# EAGLE design Adafruit RGB Matrix HAT (EAGLE 9.6.2)
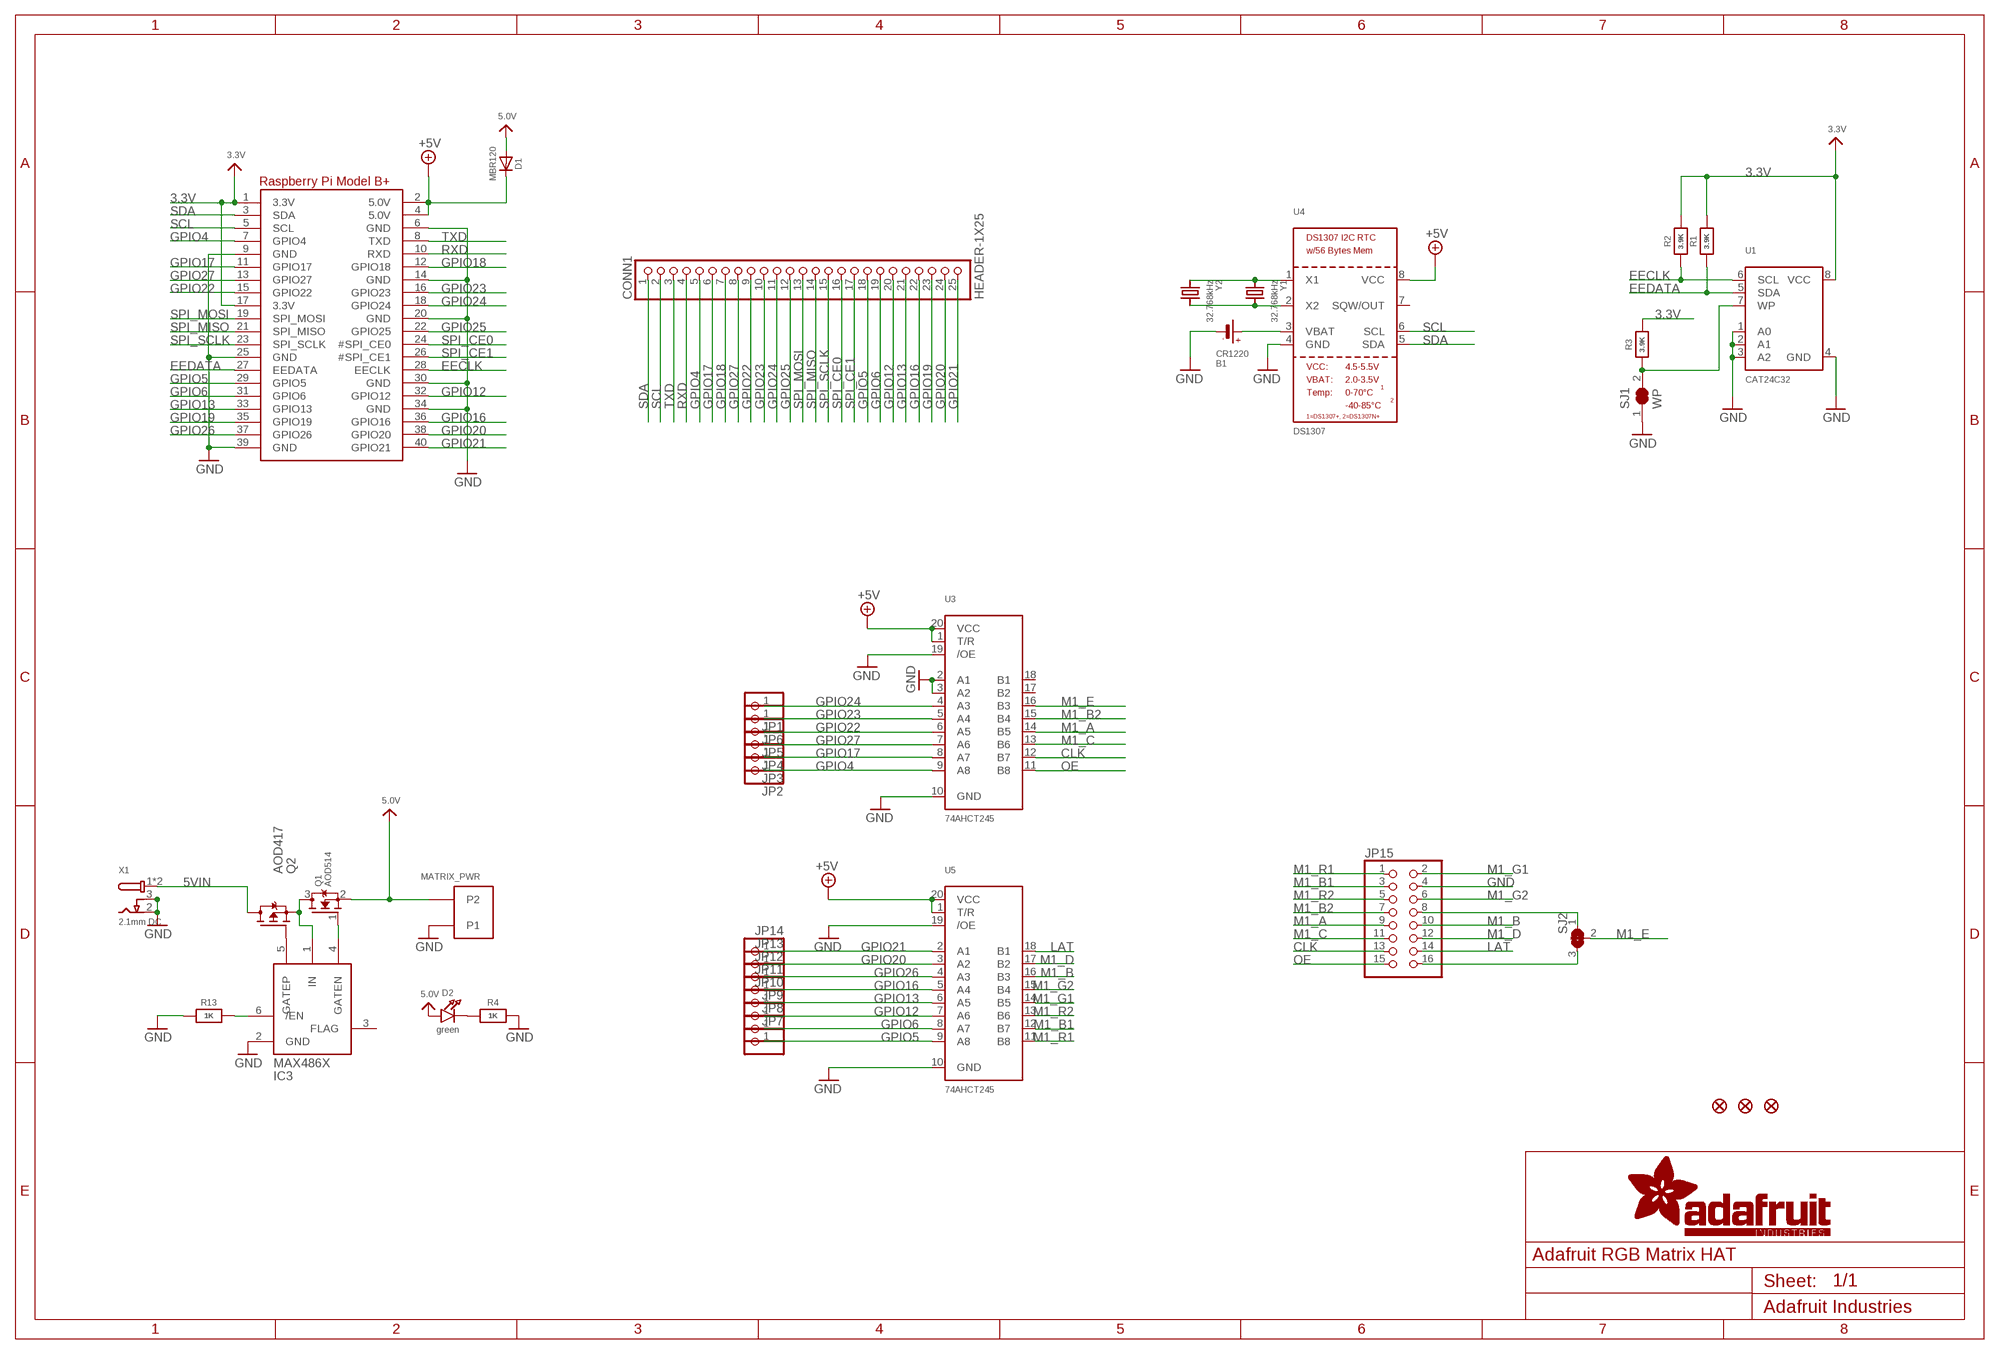
[diagram p0: schematic, sheet 1]

## Parts
B1  CR1220  BATTERYCR1220_SMT  [CR1220]
CONN1  HEADER-1X25  [1X25_ROUND_70MIL]
D1  MBR120  DIODESOD-123  [SOD-123]
D2  green  LED0805_NOOUTLINE  [CHIPLED_0805_NOOUTLINE]
FID1  FIDUCIAL_1MM  [FIDUCIAL_1MM]
FID2  FIDUCIAL_1MM  [FIDUCIAL_1MM]
FID3  FIDUCIAL_1MM  [FIDUCIAL_1MM]
IC3  MAX4866T  MAX486X/SOT  [SOT23-6]
JP1  PINHD-1X1  [1X01]
JP2  PINHD-1X1  [1X01]
JP3  PINHD-1X1  [1X01]
JP4  PINHD-1X1  [1X01]
JP5  PINHD-1X1  [1X01]
JP6  PINHD-1X1  [1X01]
JP7  PINHD-1X1  [1X01]
JP8  PINHD-1X1  [1X01]
JP9  PINHD-1X1  [1X01]
JP10  PINHD-1X1  [1X01]
JP11  PINHD-1X1  [1X01]
JP12  PINHD-1X1  [1X01]
JP13  PINHD-1X1  [1X01]
JP14  PINHD-1X1  [1X01]
JP15  HEADER-2X8_SHROUDED  [2X08_SHROUDED]
MATRIX_PWR  PINHEAD  [TERMBLOCK508]
Q1  AOD514  MOSFET-N_TO252  [TO252]
Q2  AOD417  MOSFET-PTO252  [TO252]
R1  3.9K  RESISTOR0805_NOOUTLINE  [0805-NO]
R2  3.9K  RESISTOR0805_NOOUTLINE  [0805-NO]
R3  3.9K  RESISTOR0805_NOOUTLINE  [0805-NO]
R4  1K  RESISTOR0805_NOOUTLINE  [0805-NO]
R13  1K  RESISTOR0805_NOOUTLINE  [0805-NO]
RPI1  RASPBERRYPI_BPLUS_HATSLOTS  [PI_HAT_SLOTS]
SJ1  WP  SOLDERJUMPER_CLOSED  [SOLDERJUMPER_CLOSEDWIRE]
SJ2  SOLDERJUMPER_2WAY  [SOLDERJUMPER_2WAY_OPEN_NOPASTE]
U1  CAT24C32  EEPROM_I2C_8PIN_GENERIC  [SOIC8_150MIL]
U3  74AHCT245  74LCX245_TSSOP20  [TSSOP20]
U4  DS1307  RTC_DS1307  [SOIC8_150MIL]
U5  74AHCT245  74LCX245_TSSOP20  [TSSOP20]
X1  2.1mm DC  DCBARRELSMT  [DCJACK_2MM_SMT]
Y1  32.768kHz  CRYSTAL8.0X3.8  [CRYSTAL_8X3.8]
Y2  32.768kHz  CRYSTAL_3215  [XTAL3215]

## Nets
3.3V: R1.2 R2.2 R3.2 RPI1.1(3.3V) RPI1.17(3.3V) U1.8(VCC)
5.0V: D1.A D2.A MATRIX_PWR.P$4(P2) Q1.2(S)
5VIN: Q2.3(D) X1.1'(PWR) X1.1(PWR)
+5V: D1.C RPI1.2(5.0V) RPI1.4(5.0V) U3.1(T/R) U3.20(VCC) U4.8(VCC) U5.1(T/R) U5.20(VCC)
CLK: JP15.13 U3.12(B7)
EECLK: R2.1 RPI1.28(EECLK) U1.6(SCL)
EEDATA: R1.1 RPI1.27(EEDATA) U1.5(SDA)
GND: B1.- IC3.2(GND) JP15.4 MATRIX_PWR.P$3(P1) R4.2 R13.1 RPI1.6(GND) RPI1.9(GND) RPI1.14(GND) RPI1.20(GND) RPI1.25(GND) RPI1.30(GND) RPI1.34(GND) RPI1.39(GND) SJ1.1 U1.1(A0) U1.2(A1) U1.3(A2) U1.4(GND) U3.2(A1) U3.3(A2) U3.10(GND) U3.19(/OE) U4.4(GND) U5.10(GND) U5.19(/OE) X1.2(GND) X1.3(GNDBREAK)
GPIO4: CONN1.5 JP2.1 RPI1.7(GPIO4) U3.9(A8)
GPIO5: CONN1.18 JP7.1 RPI1.29(GPIO5) U5.9(A8)
GPIO6: CONN1.19 JP8.1 RPI1.31(GPIO6) U5.8(A7)
GPIO12: CONN1.20 JP9.1 RPI1.32(GPIO12) U5.7(A6)
GPIO13: CONN1.21 JP10.1 RPI1.33(GPIO13) U5.6(A5)
GPIO16: CONN1.22 JP11.1 RPI1.36(GPIO16) U5.5(A4)
GPIO17: CONN1.6 JP3.1 RPI1.11(GPIO17) U3.8(A7)
GPIO18: CONN1.7 RPI1.12(GPIO18)
GPIO19: CONN1.23 RPI1.35(GPIO19)
GPIO20: CONN1.24 JP13.1 RPI1.38(GPIO20) U5.3(A2)
GPIO21: CONN1.25 JP14.1 RPI1.40(GPIO21) U5.2(A1)
GPIO22: CONN1.9 JP5.1 RPI1.15(GPIO22) U3.6(A5)
GPIO23: CONN1.10 JP6.1 RPI1.16(GPIO23) U3.5(A4)
GPIO24: CONN1.11 JP1.1 RPI1.18(GPIO24) U3.4(A3)
GPIO25: CONN1.12 RPI1.22(GPIO25)
GPIO26: JP12.1 RPI1.37(GPIO26) U5.4(A3)
GPIO27: CONN1.8 JP4.1 RPI1.13(GPIO27) U3.7(A6)
LAT: JP15.14 U5.18(B1)
M1_A: JP15.9 U3.14(B5)
M1_B: JP15.10 U5.16(B3)
M1_B1: JP15.3 U5.12(B7)
M1_B2: JP15.7 U3.15(B4)
M1_C: JP15.11 U3.13(B6)
M1_D: JP15.12 U5.17(B2)
M1_E: SJ2.2 U3.16(B3)
M1_E': JP15.8 SJ2.1
M1_E'': JP15.16 SJ2.3
M1_G1: JP15.2 U5.14(B5)
M1_G2: JP15.6 U5.15(B4)
M1_R1: JP15.1 U5.11(B8)
M1_R2: JP15.5 U5.13(B6)
N$1: IC3.6(/EN) R13.2
N$2: U4.1(X1) Y1.P$1 Y2.P$1
N$3: U4.2(X2) Y1.P$4 Y2.P$2
N$4: D2.C R4.1
N$5: IC3.1(IN) Q1.3(D) Q2.2(S)
N$6: IC3.4(GATEN) Q1.1(G)
N$7: IC3.5(GATEP) Q2.1(G)
N$14: B1.+$1(+) B1.+$2(+) U4.3(VBAT)
N$16: R3.1 SJ1.2 U1.7(WP)
OE: JP15.15 U3.11(B8)
RXD: CONN1.4 RPI1.10(RXD)
SCL: CONN1.2 RPI1.5(SCL) U4.6(SCL)
SDA: CONN1.1 RPI1.3(SDA) U4.5(SDA)
SPI_CE0: CONN1.16 RPI1.24(#SPI_CE0)
SPI_CE1: CONN1.17 RPI1.26(#SPI_CE1)
SPI_MISO: CONN1.14 RPI1.21(SPI_MISO)
SPI_MOSI: CONN1.13 RPI1.19(SPI_MOSI)
SPI_SCLK: CONN1.15 RPI1.23(SPI_SCLK)
TXD: CONN1.3 RPI1.8(TXD)
Unconnected: IC3.3(FLAG) U3.17(B2) U3.18(B1) U4.7(SQW/OUT)

## Library data of the parts
B1 = microbuilder:BATTERY: CR1220 SMT - Digikey: 3001K-ND CD2032 BAT-HLD-001 - Digikey: BAT-HLD-001-ND
CONN1 = microbuilder:HEADER-1X25
D1 = microbuilder:DIODE: Diode SMA Model Volts Amps Type Vf Ir Digikey # Notes SSA34-E3 40V 3A Schottky 480mV @ 3A 200uA @ 40V SSA34-E3/61TGITR-ND CDBA120-G 20V 1A Schottky 500mV @ 1A 500uA @ 20V 641-1014-6-ND REEL MBRA210 10V 2A Schottky 350mV @ 2A 700uA @ 10V MBRA210LT3 SOD-123 Model Volts Amps Type Vf Ir Order # Notes BAT54T1G 30V 200mA Schottky 800mV @ 200mA 2uA @ 25V BAT54T1GOSTR-ND B0530W 30V 500mA Schottky 430mV @ 500mA 130uA @ 30V B0530W-FDICT-ND REEL MBR120 20V 1A Schottky 340mV @ 1A MBR120VLSFT1GOSCT-ND SOD-323 Model Volts Amps Type Vf Ir Order # Notes PMEG2005EJ 20V 500mA Schottky 355mV @ 500mA 568-4110-1-ND ZLLS410 10V 570mA Schottky 380mV @ 570mA ZLLS410CT-ND 1N4148WS 75V 150mA Silicon/Simple 1V 1N4148WSFSCT-ND REEL SOD-523 Model Volts Amps Type Vf Ir Order # Notes BAT54XV2 30V 200mA Schottky 0.8V @ 100mA BAT54XV2CT-ND TB751S 30V 30mA Schottky RB751S-40TE61CT-ND SOT23-R/W (R = Solder Paste/Reflow Ovens, W = Hand-Soldering) Model Volts Amps Type Vf Ir Order # Notes BAT54FILM 40V 300mA Schottky 497-7162-1-ND POWERDI-5 Model Volts Amps Type Vf Ir Order # Notes PDS560 60V 5A Schottky 670mV @ 5A 150uA @ 60V PDS560DICT-ND
D2 = microbuilder:LED: LED 0603 - 0603 Surface Mount Package 2mA: Green LED - Low Power (3.9mcd, 2ma, 1.7Vf) - Digikey: 475-2709-2-ND Orange LED - Low Power (9.8mcd, 2ma, 1.8Vf) - Digikey: 475-1194-2-ND Red LED - Low Power (5mcd, 2ma, 1.8Vf) - Digikey: 475-1195-2-ND Yellow LED - Low Power (7mcd, 2ma, 1.8Vf) - Digikey: 475-1196-2-ND 5mA: Blue LED - Low Power (17mcd, 5ma, 2.9Vf) - Digikey: LNJ937W8CRACT-ND 0805 - 0805 Surface Mount Package 2mA: Red LED (8.8mcd, 2mA, 1.8Vf, Clear) - Low Power [Digikey: 475-2510-1-ND] Green LED (5mcd, 2mA, 1.8Vf, Clear) - Low Power [Digikey: 475-2730-1-ND] Yellow LED (11.3mcd, 2mA, 1.8Vf, Clear) - Low Power [Digikey: 475-2555-1-ND] 20mA: Red LED (104mcd, 20mA, Diffused) - LS R976 [Digikey: 475-1278-6-ND] Red LED (12mcd, 20mA, 2.0Vf, Clear) - APT2012EC [Digikey: 754-1128-1-ND] Green LED (15mcd, 20mA, 2.2Vf, Clear) - APT2012GC [Digikey: 754-1131-1-ND] Orange LED (160mcd, 20mA, 2.1Vf, Clear) - APT2012SECK [Digikey: 754-1130-1-ND] 1206 - 1206 Surface Mount Package Green LED (26mcd, 20mA, Diffused) - LG N971 [Digikey: 475-1407-6-ND] Red LED (15mcd, 20mA, Diffused) - LH N974 [Digikey: 475-1416-6-ND] Cree - Cree High-Power Surface Mount LEDs XPEBWT-L1-0000-00D50 - White 111lm 350mA 2.9Vf 6200K 110° XTEAWT-00-0000-00000LEE3 - White 114lm 350mA 2.85Vf 5000K 115° Everlight - Everlight 45-21 Series Surface Mount LEDs 45-21/QK2C-B2832AC2CB2/2T - Warm White 2000mcd 20mA 3.25Vf 3050K 120° 45-21/LK2C-B38452C4CB2/2T - Nuetral White 2000mcd 20mA 3.25Vf 4150K 120° 45-21/LK2C-B50634C6CB2/2T - Cold White 2200mcd 20mA 3.25Vf 5650K 120° PLCC2 Reverse Mount LS T77K-J1L2-1-0-2-R18-Z - Red 11.25mcd 2mA 1.8Vf 630nm 120° LO T77K-L1M2-24-Z - Orange 19.6mcd 2mA 1.8Vf 606nm 120° LY T77K-K2M1-26-Z - Yellow 15.7mcd 2mA 1.8Vf 587nm 120°; ROT: 270
FID1-FID3 = microbuilder:FIDUCIAL: Fiducial Alignment Points Various fiducial points for machine vision alignment.; BOM: EXCLUDE
IC3 = adafruit:MAX486X
JP1-JP14 = pinhead-ez:PINHD-1X1: PIN HEADER
JP15 = microbuilder:HEADER-2X8
MATRIX_PWR = mshield:PINHEAD
Q1 = microbuilder:MOSFET-N: N-Channel Mosfet LEGEND VDS: Voltage Drain-Source ID: Drain Current RDS(ON): Drain-Source On-State Resistance VGS(TH): Gate-Source Threshold Voltage CISS: Drain-Source Input Capacitance SOT-23 Name VDS ID RDS(ON) VGS(TH) CISS Order Number 2N7002E 60V 260mA 2.5 Ohm 2.5V @ 250uA 26.7pF @ 25V 2N7002ET1GOSTR-ND BSH103 30V 850mA 400 mOhm 400mV @ 1mA 83pF @ 24V BSH103,235-ND BSS138 60V 320mA 1.6 Ohm 1.5V @ 250uA 50pF @ 10V Mouser: 771-BSS138PW115 DMN2075U-7 20V 4.2A 38 mOhm 1V @ 250 uA 594.3pF @ 10V DMN2075U-7DICT-ND * BSS138 good choice for I2C level-shifting POWERPAK 1212-8 Name VDS ID RDS(ON) VGS(TH) CISS Order Number Si7308DN 60V 6A 58 mOhm 3V @ 250uA 665pF @ 15V SI7308DN-T1-E3CT-ND
Q2 = microbuilder:MOSFET-P: P-Channel Mosfet LEGEND VDS: Voltage Drain-Source ID: Drain Current RDS(ON): Drain-Source On-State Resistance VGS(TH): Gate-Source Threshold Voltage CISS: Drain-Source Input Capacitance SOT-23 Name VDS ID RDS(ON) VGS(TH) CISS Order Number IRLML5103 30V 760mA 600 mOhm -- 75pF @ 25V Digikey: IRLML5103PBFCT-ND IRLML6401 12V 4.3A 50 mOhm 950mV @ 250µA 830pF @ 10V Digikey: IRLML6401PBFTR-ND NTR0202PL 20V 400mA 800 mOhm 2.3V @ 250uA 70pF @ 5V Digikey: NTR0202PLT1GOSTR-ND NTR4101PT1G 20V 1.8A 85 mOhm 1.2V @ 250uA 675pF @ 10V Digikey: NTR4101PT1GOSCT-ND DMP2004K 20V 600mA 900 mOhm 1V @ 250uA 175pF @ 16V Digikey: DMP2004KDICT-ND PMV65XP 20V 3.9A 76 mOhm 950mV @ 1mA 725pF @ 20V Digikey: 568-2358-2-ND TO-252 Name VDS ID RDS(ON) VGS(TH) CISS Order Number AOD417 30V 25A 34 mOhm 3V @ 250µA 920pF @ 15V Digikey: 785-1106-2-ND PowerPak Name VDS ID RDS(ON) VGS(TH) CISS Order Number AON7401 30V 12A 14 mOhm 3V @ 250µA 2600pF @ 15V Digikey: 785-1302-1-ND
R1-R4 R13 = microbuilder:RESISTOR: Resistors For new designs, use the packages preceded by an '_' character since they are more reliable: The following footprints should be used on most boards: _0402 - Standard footprint for regular board layouts _0603 - Standard footprint for regular board layouts _0805 - Standard footprint for regular board layouts _1206 - Standard footprint for regular board layouts For extremely tight-pitch boards where space is at a premium, the following 'micro-pitch' footprints can be used (smaller pads, no silkscreen outline, etc.): _0402MP - Micro-pitch footprint for very dense/compact boards _0603MP - Micro-pitch footprint for very dense/compact boards _0805MP - Micro-pitch footprint for very dense/compact boards _1206MP - Micro-pitch footprint for very dense/compact boards
RPI1 = adafruit_sbc:RASPBERRYPI_BPLUS
SJ1 = microbuilder:SOLDERJUMPER_CLOSED: Solder Jumper - Closed These solder jumpers are closed by default CLOSEDWIRE - 10 mil trace between pads that can be cut and resoldered later CLOSEDPERM - 63 mil trace between pads for a permanent connection (used to 'bridge' two signals, a shameless hack for Eagle). Can double as a test point as well (no cream layer)
SJ2 = microbuilder:SOLDERJUMPER_2WAY: 2-Way Solder Jumper
U1 = microbuilder:EEPROM_I2C_8PIN_GENERIC: Note: The same pinout is used for many I2C EEPROMs in SOIC8(150mil) from a variety of manufacturers and in various sizes. Examples: 16K (2K x 8 Bit) I2C EEPROM 1.7-5.5V, 400KHz, -40°C-85°C Digikey: CAT24C16WI-GT3CT-ND 256K (32K x 8 Bit) I2C EEPROM 1.7-5.5V, 400KHz, -40°C-85°C Digikey: 24AA256-I/SN-ND
U3 U5 = microbuilder:74LCX245: 74LCX245MTC - 5.0V Tolerant Bi-Directional Buffer Can be used to interface 5.0V logic to 2.5 or 3.3V devices Digikey: 74LCX245MTCXTR-ND Mouser: 512-74LCX245MTCX
U4 = microbuilder:RTC_DS1307: DS1307 I2C RTC with 56-Bytes RAM
X1 = adafruit_electromech:DCBARREL: DC Barrel Jack DCJACK_1.3MM_PTH - Through Hole 1.3mm Jack (4UConnector: 05536) DCJACK_2MM_PTH - Through Hole 2.0/2.1 Jack (4UConnector: 05537) DCJACK_2MM_SMT - SMT 2.0/2.1mm Jack(4UConnector: 03267)
Y1 Y2 = microbuilder:CRYSTAL: Crystals HC49UP - Surface Mount Crystal 4.0MHz 18pF +/-30ppm Surface Mount Crystal [Digikey: 535-9857-1-ND] 12.0 MHz Surface Mount Crystal [Digikey: 535-9869-6-ND] 25.0 MHz Surface Mount Crystal [Digikey: 535-9078-1-ND] 2.5 x 2.0mm - MEMs SMT Crystal 16.0 MHz 10pF 20ppm 2.5 x 2.0mm Crystal [Digikey -40-85°C: 535-10923-1-ND] 3.2 x 2.5mm - MEMs SMT Crystal 12.0 MHz 8pF 15ppm 3.2 x 2.5mm Crystal [Digikey: -10-70°C: 644-1047-1-ND -40-125°C: 644-1128-1-ND] 40~85°C cheaper: 644-1173-6-ND 16.0 MHz 8pF 15ppm 3.2 x 2.5mm Crystal [Digikey: -10-70°C: 644-1049-1-ND -40-125°C: 644-1129-2-ND]-40~85°C cheaper: 644-1175-6-ND 16.0 MHz 10pF 10ppm 3.2 x 2.5mm Crystal [Digikey: 644-1100-1-ND] 27.12 MHz 18pF 30ppm 3.2 x 2.5mm Crystal [Digikey: 887-1424-1-ND] 27.12MHz 10pF 10ppm 3.2 x 2.5mm Crystal [Digikey: 887-1329-1-ND] 4.9 x 1.8mm - MEMs SMT Crystal 32.768 KHz 12.5pF 20ppm 4.9 x 1.8mm Crystal [Digikey: SE2415CT-ND] 8.0 x 3.8mm - Surface Mount Crystal 32.768kHz 12.5pF 20ppm -40°C-85°C [Digikey: 535-9166-2-ND] Cylinder 32.768KHz Cylinder Crystal (2x6mm body) [Ex. Digikey: 300-8341-2-ND]

## Board
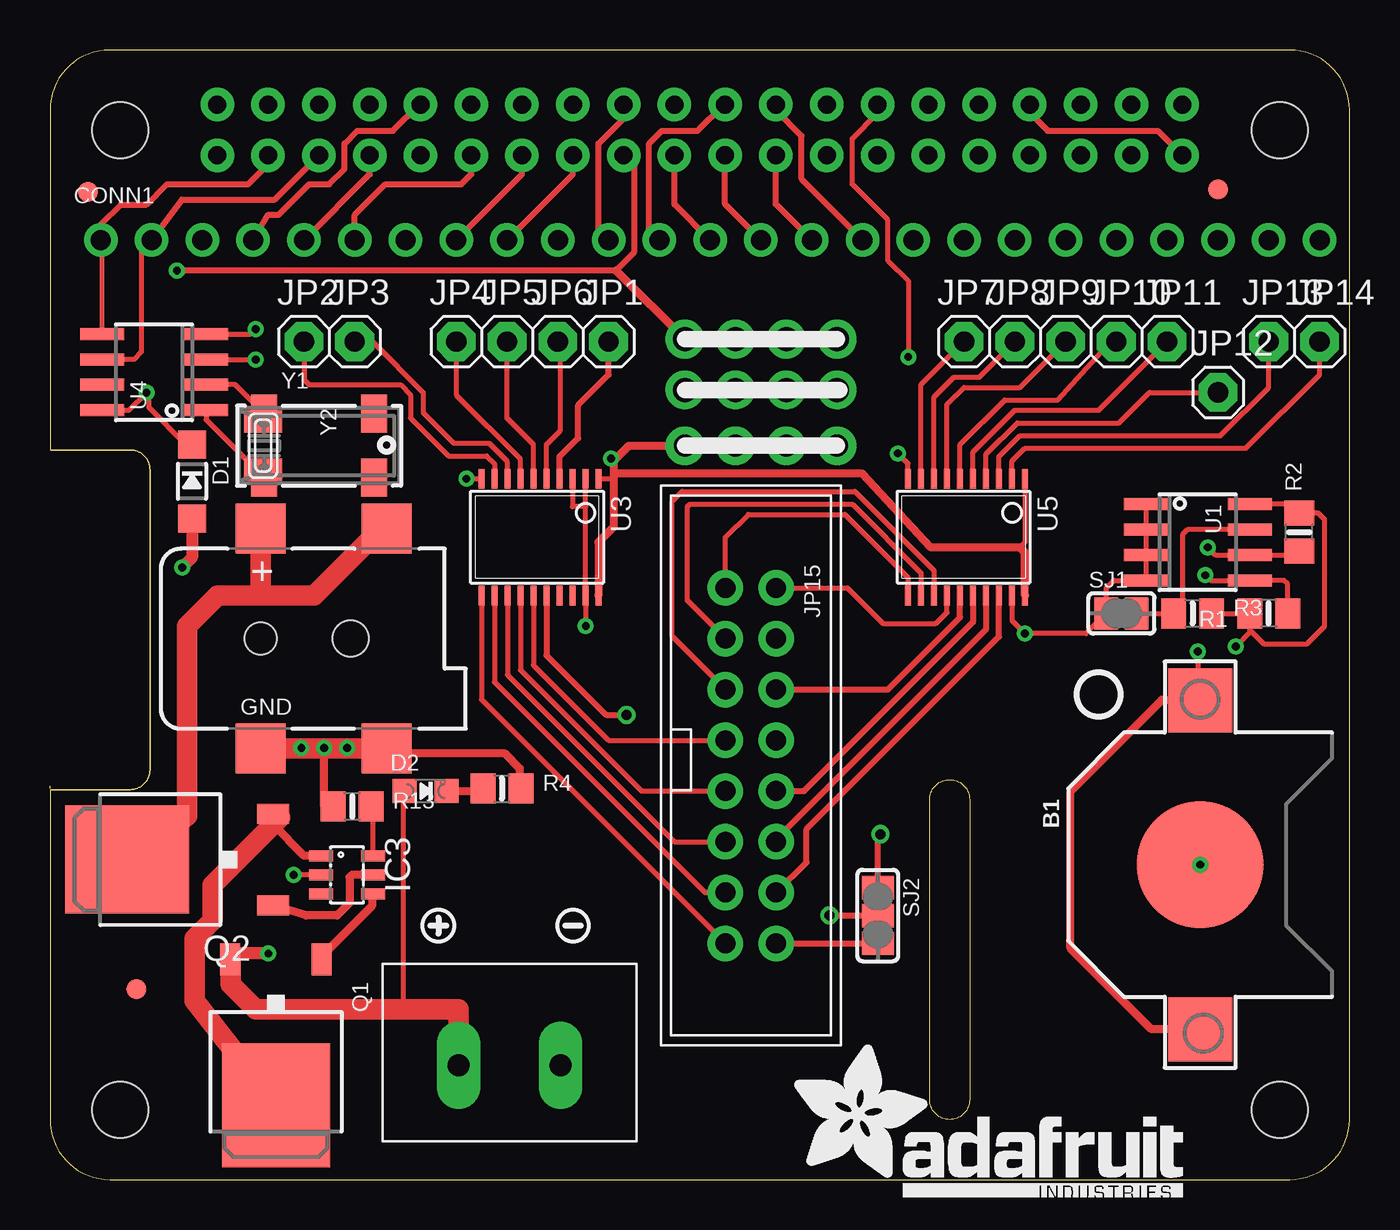
[diagram p1: board, top side]
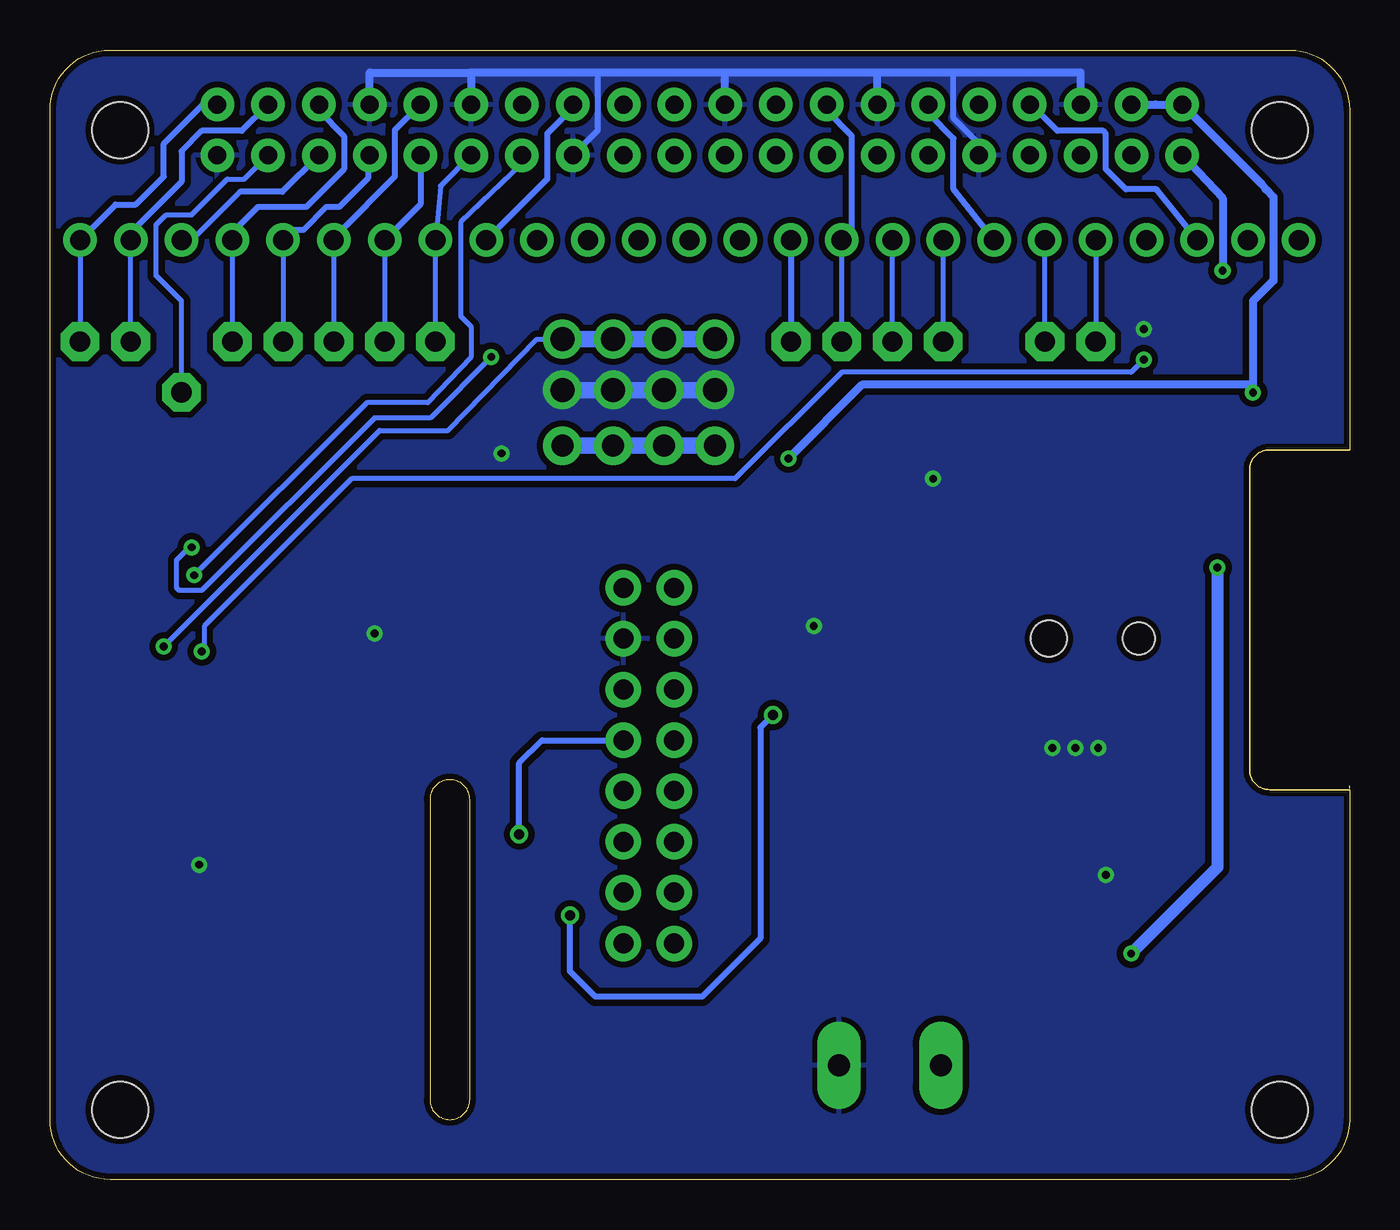
[diagram p2: board, bottom side, seen from below]

Size 65 x 56.5 mm. Coordinates in mm from the lower left corner, seen from the top.
Outline: 0,19.56 0,19.68
Outline: 0,19.5 0,3 arc90 3,0 62,0 arc90 65,3 65,53.5 arc90 62,56.5 3,56.5 arc90 0,53.5 0,36.5 4,36.5 arc-90 5,35.5 5,20.5 arc-90 4,19.5 0,19.5
Copper layers (1*16): Top 0.035mm / dielectric 1.5mm / Bottom 0.035mm
Design rules "adafruit *": minimum track width 8mil, minimum drill 15.5mil, track to track 8mil, track to pad 8mil, pad to pad 8mil, via to via 8mil, smd to smd 8mil, copper to edge 10mil, drill to drill 8mil, minimum pad ring 10mil, minimum via ring 8mil, stop-mask expansion 2mil, vias tented up to drill 20mil, thermal gap 10mil

### Footprints (pad centres in the part's own frame; a part is rotated, then mirrored left to right if it is on the bottom)
CR1220 = smd 3.2 x 3.2: +$1 -8.225,0; +$2 8.225,0 | smd 6.35 x 6.35: - 0,0
1X25_ROUND_70MIL = drill 1 pad 1.676: 1 -30.48,0; 2 -27.94,0; 3 -25.4,0; 4 -22.86,0; 5 -20.32,0; 6 -17.78,0; 7 -15.24,0; 8 -12.7,0; 9 -10.16,0; 10 -7.62,0; 11 -5.08,0; 12 -2.54,0; 13 0,0; 14 2.54,0; 15 5.08,0; 16 7.62,0; 17 10.16,0; 18 12.7,0; 19 15.24,0; 20 17.78,0; 21 20.32,0; 22 22.86,0; 23 25.4,0; 24 27.94,0; 25 30.48,0
SOD-123 = smd 1.4 x 1.4: A 1.85,0; C -1.85,0
CHIPLED_0805_NOOUTLINE = smd 1.2 x 1.2: A 0,-1.05; C 0,1.05
FIDUCIAL_1MM = smd 1 x 1: 1 0,0
SOT23-6 = smd 0.55 x 1.2: 1 -0.95,-1.3; 2 0,-1.3; 3 0.95,-1.3; 4 0.95,1.3; 5 0,1.3; 6 -0.95,1.3
1X01 = drill 1.016 pad 1.93 octagon: 1 0,0
2X08_SHROUDED = drill 1 pad 1.778: 1 -8.89,-1.27; 2 -8.89,1.27; 3 -6.35,-1.27; 4 -6.35,1.27; 5 -3.81,-1.27; 6 -3.81,1.27; 7 -1.27,-1.27; 8 -1.27,1.27; 9 1.27,-1.27; 10 1.27,1.27; 11 3.81,-1.27; 12 3.81,1.27; 13 6.35,-1.27; 14 6.35,1.27; 15 8.89,-1.27; 16 8.89,1.27
TERMBLOCK508 = drill 1.1 pad 2.184 long: P$3 -2.54,0; P$4 2.54,0
TO252 = smd 1 x 1.6: 1 -2.28,-3.657; 2 2.28,-3.657 | smd 5.4 x 6.2: 3 0,3.643
0805-NO = smd 1.24 x 1.5: 1 -0.95,0; 2 0.95,0
PI_HAT_SLOTS = drill 0.9 pad 1.676: 1 8.37,51.23; 2 8.37,53.77; 3 10.91,51.23; 4 10.91,53.77; 5 13.45,51.23; 6 13.45,53.77; 7 15.99,51.23; 8 15.99,53.77; 9 18.53,51.23; 10 18.53,53.77; 11 21.07,51.23; 12 21.07,53.77; 13 23.61,51.23; 14 23.61,53.77; 15 26.15,51.23; 16 26.15,53.77; 17 28.69,51.23; 18 28.69,53.77; 19 31.23,51.23; 20 31.23,53.77; 21 33.77,51.23; 22 33.77,53.77; 23 36.31,51.23; 24 36.31,53.77; 25 38.85,51.23; 26 38.85,53.77; 27 41.39,51.23; 28 41.39,53.77; 29 43.93,51.23; 30 43.93,53.77; 31 46.47,51.23; 32 46.47,53.77; 33 49.01,51.23; 34 49.01,53.77; 35 51.55,51.23; 36 51.55,53.77; 37 54.09,51.23; 38 54.09,53.77; 39 56.63,51.23; 40 56.63,53.77 | hole 2.8: 3.5,3.5; 3.5,52.5; 61.5,52.5; 61.5,3.5
SOLDERJUMPER_CLOSEDWIRE = smd 1.168 x 1.6: 1 -0.762,0; 2 0.762,0 | smd 0.635 x 0.203: WIRE 0,0
SOLDERJUMPER_2WAY_OPEN_NOPASTE = smd 1.168 x 1.6: 1 -1.397,0; 2 0,0; 3 1.397,0
SOIC8_150MIL = smd 0.6 x 2.2: 1 -1.905,-2.6; 2 -0.635,-2.6; 3 0.635,-2.6; 4 1.905,-2.6; 5 1.905,2.6; 6 0.635,2.6; 7 -0.635,2.6; 8 -1.905,2.6
TSSOP20 = smd 0.305 x 0.991: 1 -2.925,-2.918; 2 -2.275,-2.918; 3 -1.625,-2.918; 4 -0.975,-2.918; 5 -0.325,-2.918; 6 0.325,-2.918; 7 0.975,-2.918; 8 1.625,-2.918; 9 2.275,-2.918; 10 2.925,-2.918; 11 2.925,2.918; 12 2.275,2.918; 13 1.625,2.918; 14 0.975,2.918; 15 0.325,2.918; 16 -0.325,2.918; 17 -0.975,2.918; 18 -1.625,2.918; 19 -2.275,2.918; 20 -2.925,2.918
DCJACK_2MM_SMT = smd 2.5 x 2.5: 1 -3.175,5.5; 1' 3.125,5.5; 2 -3.175,-5.5; 3 3.125,-5.5 | hole 1.6: -3.175,0 | hole 1.8: 1.325,0
CRYSTAL_8X3.8 = smd 1.3 x 1.9: P$1 -2.75,-1.6; P$2 2.75,-1.6; P$3 2.75,1.6; P$4 -2.75,1.6
XTAL3215 = smd 1.1 x 1.9: P$1 1.2,0; P$2 -1.2,0

### Placement (x,y rotation side)
B1  57.53,15.75 270 top
CONN1  33.02,46.99 0 top
D1  7.11,34.92 270 top
D2  18.8,19.43 270 top
FID1  1.91,49.4 0 top
FID2  4.32,9.53 0 top
FID3  58.42,49.53 0 top
IC3  14.86,15.24 270 top
JP1  27.94,41.91 0 top
JP2  12.7,41.91 0 top
JP3  15.24,41.91 0 top
JP4  20.32,41.91 0 top
JP5  22.86,41.91 0 top
JP6  25.4,41.91 0 top
JP7  45.72,41.91 0 top
JP8  48.26,41.91 0 top
JP9  50.8,41.91 0 top
JP10  53.34,41.91 0 top
JP11  55.88,41.91 0 top
JP12  58.42,39.37 0 top
JP13  60.96,41.91 0 top
JP14  63.5,41.91 0 top
JP15  35.05,20.7 270 top
MATRIX_PWR  22.99,5.71 180 top
PLABEL0  [PLABEL0]  42.29,36.7 0 top
PLABEL1  [PLABEL1]  42.8,39.5 0 top
PLABEL2  [PLABEL2]  42.04,42.04 0 top
PLABEL3  [PLABEL3]  2.67,45.34 0 top
PLABEL4  [PLABEL4]  5.21,48.64 0 top
PLABEL5  [PLABEL5]  7.75,45.34 0 top
PLABEL6  [PLABEL6]  10.29,48.64 0 top
PLABEL7  [PLABEL7]  12.7,45.34 0 top
PLABEL8  [PLABEL8]  15.37,48.64 0 top
PLABEL9  [PLABEL9]  17.78,45.34 0 top
PLABEL10  [PLABEL10]  20.32,48.64 0 top
PLABEL11  [PLABEL11]  22.86,45.34 0 top
PLABEL12  [PLABEL12]  25.4,48.64 0 top
PLABEL13  [PLABEL13]  27.94,45.34 0 top
PLABEL14  [PLABEL14]  30.48,48.64 0 top
PLABEL15  [PLABEL15]  33.02,45.34 0 top
PLABEL16  [PLABEL16]  35.69,48.64 0 top
PLABEL17  [PLABEL17]  38.1,45.34 0 top
PLABEL18  [PLABEL18]  40.64,48.64 0 top
PLABEL19  [PLABEL19]  43.18,45.34 0 top
PLABEL20  [PLABEL20]  45.72,48.64 0 top
PLABEL21  [PLABEL21]  48.26,45.34 0 top
PLABEL22  [PLABEL22]  50.8,48.64 0 top
PLABEL23  [PLABEL23]  53.34,45.34 0 top
PLABEL24  [PLABEL24]  55.88,48.64 0 top
PLABEL25  [PLABEL25]  58.42,45.34 0 top
PLABEL26  [PLABEL26]  61.09,48.64 0 top
PLABEL27  [PLABEL27]  63.63,45.47 0 top
PLABEL28  [PLABEL28]  52.58,26.04 0 top
PLABEL29  [PLABEL29]  23.11,12.45 0 top
PLABEL30  [PLABEL30]  23.11,16.26 0 top
PLABEL31  [PLABEL31]  40.89,21.84 90 top
PLABEL32  [PLABEL32]  12.83,39.88 0 top
PLABEL33  [PLABEL33]  15.24,39.88 0 top
PLABEL34  [PLABEL34]  20.32,40.01 90 top
PLABEL35  [PLABEL35]  22.86,40.01 90 top
PLABEL36  [PLABEL36]  25.4,39.75 90 top
PLABEL37  [PLABEL37]  45.72,39.62 90 top
PLABEL38  [PLABEL38]  48.26,39.75 90 top
PLABEL39  [PLABEL39]  50.8,39.62 90 top
PLABEL40  [PLABEL40]  53.34,39.62 90 top
PLABEL41  [PLABEL41]  55.88,39.62 90 top
PLABEL42  [PLABEL42]  58.42,41.4 90 top
PLABEL43  [PLABEL43]  58.17,37.34 0 top
PLABEL44  [PLABEL44]  60.96,40.01 90 top
PLABEL45  [PLABEL45]  63.5,39.24 90 top
PLABEL46  [PLABEL46]  48.51,14.73 90 top
PLABEL47  [PLABEL47]  21.34,23.62 0 top
PLABEL48  [PLABEL48]  27.94,40.13 90 top
PLABEL49  [PLABEL49]  41.4,10.03 0 top
PLABEL50  [PLABEL50]  41.53,16.26 0 top
PLABEL51  [PLABEL51]  43.18,13.21 90 top
Q1  11.3,7.37 180 top
Q2  7.49,16 90 top
R1  60.96,28.32 180 top
R2  62.48,32.38 90 top
R3  57.15,28.32 0 top
R4  22.61,19.56 0 top
R13  15.11,18.67 0 top
RPI1  0,0 0 top
SJ1  53.59,28.32 0 top
SJ2  41.4,13.21 270 top
U1  57.4,31.88 270 top
U3  24.51,32.13 180 top
U4  5.21,40.39 90 top
U5  45.85,32.13 180 top
U$3  [PCBFEAT-REV-056]  52.45,24.26 90 top
U$10  [SYMBOL_PLUS]  19.43,12.7 0 top
U$11  [SYMBOL_MINUS]  26.16,12.7 0 top
U$12  [ADAFRUIT_TEXT_20MM]  37.08,-0.89 0 top
X1  13.72,27.05 0 top
Y1  13.46,36.7 0 top
Y2  10.67,36.7 270 top

### Tracks (layer width: path | path; a pad name or v marks a point on that pad's centre or on a via)
3.3V  (via drill 0.39, 1.2 pad 1.93)
  Top 0.254: R3.2 R1.2 60.01,27.49 60.07,27.43 | U1.8 62.04,33.78 R2.2 63.44,33.34 63.75,33.02 63.75,27.69 62.87,26.8 60.71,26.8 60.07,27.43 | 60.07,27.43 v59.31,26.67
  Top 0.305: RPI1.17 29.21,50.71 29.21,46.35 28.32,45.47 v6.35,45.47
  Top 0.406: 28.32,45.47 v31.75,42.04
  Bottom 0.254: v59.31,26.67 48.51,37.47 45.09,37.47 40.64,42.04 v39.37,42.04
  Bottom 0.406: RPI1.1 6.35,49.08 6.35,45.59 6.48,45.34 v6.35,45.47
  Bottom 0.813: v31.75,42.04 v34.29,42.04 v36.83,42.04 v39.37,42.04
5.0V  (via drill 0.39)
  Top 0.254: 17.65,19.56 17.65,8.51
  Top 0.406: 17.65,19.56 17.75,19.56 D2.A
  Top 0.61: D1.A 7.11,31.11 v6.6,30.61 | v10.92,11.3 9.08,11.3 Q1.2
  Top 1.016: Q1.2 9.04,11 9.04,9.75 10.29,8.51 17.65,8.51 20.45,8.51 MATRIX_PWR.P$4
  Bottom 0.61: v6.6,30.61 6.6,15.62 v10.92,11.3
5VIN
  Top 1.016: 10.54,29.21 13.21,29.21 16.13,32.13 16.42,32.13 X1.1' | 10.54,29.21 8.38,29.21 6.86,27.69 6.86,18.18 Q2.3 | 10.54,29.21 X1.1
+5V  (via drill 0.39, 1.1 pad 1.93)
  Top 0.254: U4.8 3.94,38.48 v4.83,39.37 | D1.C 6.79,36.77 4.95,38.61 4.95,39.24 | v28.07,36.07 28.19,35.94 | U3.1 28.19,35.05 | U5.1 48.77,31.88 48.51,31.62
  Top 0.406: 4.95,39.24 v4.83,39.37 | U5.20 48.77,31.36 48.51,31.62 44.07,31.62 40.64,35.31 28.19,35.31 | 28.19,35.31 28.19,35.05 28.19,32.64 27.44,31.88 U3.20 | 28.19,35.31 28.19,35.94 28.96,36.7 v31.75,36.7
  Bottom 0.254: 4.83,39.75 v4.83,39.37
  Bottom 0.406: RPI1.4 9.7,53.77 RPI1.2 4.38,49.78 4.19,49.53 3.81,49.15 3.81,44.96 4.83,43.94 4.83,39.75 24.38,39.75 v28.07,36.07
  Bottom 0.813: v31.75,36.7 v34.29,36.7 v36.83,36.7 v39.37,36.7
CLK
  Top 0.254: U3.12 22.24,24.88 32.77,14.35 JP15.13
EECLK  (via drill 0.39)
  Top 0.254: RPI1.28 41.39,53.33 40.13,52.07 40.13,49.78 41.91,48.01 41.91,45.97 42.93,44.96 v42.93,41.15 | R2.1 62.29,31.24 U1.6 58.29,31.24 v57.91,31.62
  Bottom 0.254: v42.93,41.15 45.97,38.1 48.77,38.1 57.4,29.46 58.55,29.46 58.67,29.59 58.67,30.99 58.04,31.62 v57.91,31.62
EEDATA  (via drill 0.39)
  Top 0.254: R1.1 61.91,29.78 61.72,29.97 U1.5 58.04,29.97 v57.78,30.23
  Bottom 0.254: RPI1.27 41.39,50.81 44.45,47.88 44.45,43.18 43.94,42.67 43.94,41.15 46.1,38.86 49.15,38.86 v57.78,30.23
GND  (via drill 0.39, 1.2 pad 1.93)
  Top 0.254: U3.10 v20.83,35.05 | v26.8,27.69 26.79,28.97 U3.19 26.79,33.66 | U4.4 10.03,42.29 v10.29,42.55 | U5.10 42.92,35.82 v42.42,36.32 | U5.19 48.12,27.95 v48.77,27.3 51.82,27.3 SJ1.1 52.83,29.59 53.21,29.97 U1.4 U1.3 U1.2 U1.1 | IC3.2 v12.19,15.24 | X1.2 10.92,21.55 13.8,21.55 v13.72,21.59 | 26.79,33.66 26.8,33.66 U3.2 | U3.3 26.14,33.66 26.79,33.66
  Top 0.305: RPI1.34 49.01,53.35 49.91,52.45 55.41,52.45 RPI1.39
  Top 0.406: 17.53,21.34 22.73,21.34 23.5,20.57 23.5,19.62 R4.2 | R13.1 13.72,18.67 v13.72,21.59
  Top 1.016: 10.92,21.55 X1.3 17.31,21.55 17.53,21.34
  Bottom 0.305: RPI1.9 18.53,51.8 19.81,53.09 19.81,55.24 19.94,55.37 | RPI1.25 37.59,52.49 37.59,55.37
  Bottom 0.406: RPI1.34 49.01,55.37 43.94,55.37 | 43.94,55.37 43.94,53.77 RPI1.30 | RPI1.20 31.23,55.37 | 31.23,55.37 37.59,55.37 43.94,55.37 | RPI1.14 23.61,55.37 | 23.61,55.37 31.23,55.37 | RPI1.6 13.45,55.37 19.94,55.37 23.61,55.37
  Bottom 0.813: v39.37,39.5 v36.83,39.5 v34.29,39.5 v31.75,39.5
  other vias: 57.53,15.75 12.57,21.59 14.86,21.59
  pour Bottom (isolate 0.305): -0.64,56.64 -0.64,0 66.04,0 66.04,56.64
GPIO4
  Top 0.254: JP2.1 12.7,40.01 12.95,39.75 17.53,39.75 18.03,39.24 18.03,38.1 19.94,36.2 21.84,36.2 22.23,35.81 22.23,35.06 U3.9
  Top 0.305: CONN1.5 15.99,50.28 RPI1.7
  Bottom 0.254: CONN1.5 JP2.1
GPIO5
  Top 0.254: U5.9 43.57,39.76 JP7.1
  Bottom 0.254: RPI1.29 45.47,49.69 CONN1.18 JP7.1
GPIO6
  Top 0.254: U5.8 44.22,39.14 45.21,40.13 46.48,40.13 JP8.1
  Bottom 0.254: CONN1.19 JP8.1
  Bottom 0.305: RPI1.31 46.47,48.78 CONN1.19
GPIO12
  Top 0.254: U5.7 44.87,38.78 45.72,39.62 48.51,39.62 JP9.1
  Bottom 0.254: JP9.1 CONN1.20
  Bottom 0.305: RPI1.32 47.75,52.49 47.75,50.16 50.55,47.37 CONN1.20
GPIO13
  Top 0.254: U5.6 45.52,36.76 47.75,38.99 50.42,38.99 52.83,41.66 53.09,41.66 JP10.1
  Bottom 0.254: CONN1.21 JP10.1
  Bottom 0.305: RPI1.33 49.1,51.23 49.1,50.09 50.55,48.64 51.18,48.64 52.32,47.5 52.83,47.5 CONN1.21
GPIO16
  Top 0.254: U5.5 46.17,36.39 48.26,38.48 52.45,38.48 JP11.1
  Bottom 0.254: CONN1.22 JP11.1
  Bottom 0.305: RPI1.36 51.55,53.45 50.29,52.2 50.29,50.55 52.2,48.64 54.61,48.64 55.63,47.62 CONN1.22
GPIO17
  Top 0.254: JP3.1 16.13,41.91 18.67,39.37 18.67,38.35 20.19,36.83 21.97,36.83 22.86,35.94 22.86,35.08 U3.8
  Top 0.305: CONN1.6 15.24,48.26 16.76,49.78 20.57,49.78 21.07,50.28 RPI1.11
  Bottom 0.254: JP3.1 CONN1.6
GPIO18
  Bottom 0.305: CONN1.7 19.81,49.53 19.81,52.07 21.07,53.33 RPI1.12
GPIO19
  Bottom 0.254: 55.5,49.4 57.66,47.24 CONN1.23
  Bottom 0.305: RPI1.35 53.38,49.4 55.5,49.4
GPIO20
  Top 0.254: U5.3 47.47,36.17 48.51,37.21 58.55,37.21 60.96,39.62 JP13.1
  Bottom 0.254: JP13.1 CONN1.24
  Bottom 0.305: RPI1.38 55.41,52.45 57.4,52.45 58.42,51.44 58.42,49.91 60.71,47.62 CONN1.24
GPIO21
  Top 0.254: U5.2 48.12,35.93 48.77,36.58 59.82,36.58 63.5,40.26 JP14.1
  Bottom 0.254: CONN1.25 JP14.1
  Bottom 0.305: CONN1.25 61.72,48.77 60.71,48.77 59.31,50.16 59.31,51.82 57.4,53.72 56.68,53.72 RPI1.40
GPIO22
  Top 0.254: U3.6 24.19,36.77 22.86,38.1 JP5.1
  Top 0.305: CONN1.9 26.15,50.28 RPI1.15
  Bottom 0.254: JP5.1 CONN1.9
GPIO23
  Top 0.254: U3.5 24.84,36.77 25.53,37.47 25.53,41.78 JP6.1
  Bottom 0.254: JP6.1 CONN1.10
  Bottom 0.305: CONN1.10 24.89,47.5 24.89,52.2 26.15,53.45 RPI1.16
GPIO24
  Top 0.305: CONN1.11 27.43,47.5 27.43,51.82 28.69,53.07 RPI1.18 | U3.4 25.49,36.15 26.42,37.08 26.42,38.73 27.94,40.26 JP1.1
  Bottom 0.305: CONN1.11 JP1.1
GPIO25
  Top 0.305: CONN1.12 29.97,47.5 29.97,51.82 30.61,52.45 32.38,52.45 33.7,53.77 RPI1.22
GPIO26
  Top 0.254: U5.4 46.82,36.28 48.39,37.85 53.47,37.85 54.99,39.37 JP12.1
  Bottom 0.254: JP12.1 58.42,43.94 59.69,45.21 59.69,47.75 59.18,48.26 57.91,48.26 56.13,50.04 55.28,50.04 RPI1.37
GPIO27
  Top 0.254: JP4.1 20.32,39.24 23.54,36.03 U3.7
  Top 0.305: CONN1.8 23.61,50.28 RPI1.13
  Bottom 0.254: JP4.1 CONN1.8
LAT
  Top 0.305: JP15.14 37.85,15.88 37.85,17.53 47.47,27.15 U5.18
M1_A
  Top 0.254: U3.14 23.54,25.49 29.59,19.43 JP15.9
M1_B
  Top 0.305: JP15.10 37.72,19.43 46.17,27.88 U5.16
M1_B1
  Top 0.254: JP15.3 31.88,28.96 31.88,33.66 32,33.78 40.13,33.78 43.57,30.34 U5.12
M1_B2
  Top 0.254: U3.15 24.19,25.73 27.94,21.97 JP15.7
M1_C
  Top 0.254: U3.13 22.89,25.25 31.24,16.89 JP15.11
M1_D
  Top 0.305: U5.17 46.82,27.52 36.32,17.02 JP15.12
M1_E  (via drill 0.5)
  Top 0.305: U3.16 24.84,26.22 27.81,23.24 v28.83,23.24 | v38.99,13.21 SJ2.2
  Bottom 0.305: v28.83,23.24 29.46,22.61 29.46,12.06 32.38,9.14 37.72,9.14 38.99,10.41 v38.99,13.21
M1_E'  (via drill 0.5)
  Top 0.305: SJ2.1 41.4,17.02 v41.53,17.27
  Bottom 0.305: v41.53,17.27 41.53,20.83 40.39,21.97 JP15.8
M1_E''
  Top 0.305: JP15.16 SJ2.3
M1_G1
  Top 0.254: JP15.2 39.88,29.59 41.66,27.81 44.32,27.81 44.87,28.36 U5.14
M1_G2
  Top 0.305: JP15.6 41.91,24.51 45.52,28.12 U5.15
M1_R1
  Top 0.254: JP15.1 33.78,32.13 34.92,33.27 39.75,33.27 42.92,30.1 U5.11
M1_R2
  Top 0.254: JP15.5 31.11,27.18 31.11,33.91 31.62,34.42 40.26,34.42 44.22,30.45 U5.13
N$1
  Top 0.254: IC3.6 16.16,18.57 R13.2
N$2
  Top 0.254: U4.1 7.81,38.01 Y1.P$1
  Top 1.016: Y2.P$1 10.67,35.15 Y1.P$1
N$3
  Top 0.254: Y1.P$4 10.54,38.48 9.26,39.75 U4.2
  Top 1.016: Y2.P$2 10.67,38.35 10.54,38.48
N$4
  Top 0.406: D2.C 21.66,19.43 R4.1
N$5
  Top 0.406: IC3.1 12.71,16.19 11.15,17.75
  Top 1.016: Q2.2 11.51,18.11 11.15,17.75 8.13,14.73 8.13,12.95 7.24,12.06 7.24,8.93 Q1.3
N$6
  Top 0.406: Q1.1 13.58,11.17 16.13,13.72 16.13,14.26 IC3.4
N$7
  Top 0.406: IC3.5 15.11,15.24 14.99,15.11 14.99,13.84 14.35,13.21 12.81,13.21 Q2.1
N$14  (via drill 0.39)
  Top 0.254: U4.3 v10.29,41.02 | v57.4,26.42 57.4,24.1 57.52,23.99 B1.+$1
  Top 0.406: B1.+$2 55.09,7.52 51.05,11.56 51.05,19.42 55.61,23.99 57.52,23.99
  Bottom 0.254: v10.29,41.02 10.92,40.39 25.4,40.39 30.73,35.05 49.91,35.05 57.28,27.69 57.28,26.54 v57.4,26.42
N$16
  Top 0.254: SJ1.2 R3.1 56.64,28.76 56.64,32.26 56.9,32.51 U1.7
OE
  Top 0.254: U3.11 21.59,24.01 JP15.15
RXD
  Top 0.305: CONN1.4 10.92,48.26 11.43,48.26 12.95,49.78 13.97,49.78 14.73,50.55 14.73,51.82 15.37,52.45 17.14,52.45 18.46,53.77 RPI1.10
SCL
  Top 0.254: CONN1.2 4.57,46.48 4.57,41.4 4.19,41.02 U4.6
  Top 0.305: CONN1.2 6.6,49.02 11.24,49.02 RPI1.5
SDA
  Top 0.254: U4.5 2.61,46.92 CONN1.1
  Top 0.305: CONN1.1 2.54,47.75 3.56,48.77 4.83,48.77 5.84,49.78 9.91,49.78 10.91,50.79 RPI1.3
SPI_CE0
  Top 0.305: CONN1.16 37.59,50.04 37.59,52.2 36.31,53.48 RPI1.24
SPI_CE1
  Bottom 0.305: RPI1.26 38.85,53.61 40.13,52.32 40.13,50.04 CONN1.17
SPI_MISO
  Top 0.305: CONN1.14 33.77,48.78 RPI1.21
SPI_MOSI
  Top 0.305: CONN1.13 31.23,48.78 RPI1.19
SPI_SCLK
  Top 0.305: CONN1.15 36.31,48.78 RPI1.23
TXD
  Bottom 0.305: CONN1.3 9.65,49.53 11.18,49.53 12.19,50.55 12.19,52.32 12.32,52.45 14.61,52.45 15.92,53.77 RPI1.8

### Text on the board
Pinguin_tBackup: SCL | RXD | 17 | 27 | 23 | 25 | MISO | CE0 | 5 | 12 | 16 | 20 | SDA | TXD | 4 | 18 | 22 | 24 | MOSI | CLK | CE1 | 6 | 13 | 19 | 21 | 3V | B | OE | CLK | C | A | B2 | E | R1 | B1 | R2 | G1 | G2 | D | GND | LAT | 5V | #26 | WP | 5VDC / Input | HUB75 | Power / Output | 8 | RGB Matrix + / Real Time Clock | E | 5V | 16